# Altium schematic sheet Reader_Schematic.SchDoc
size A4
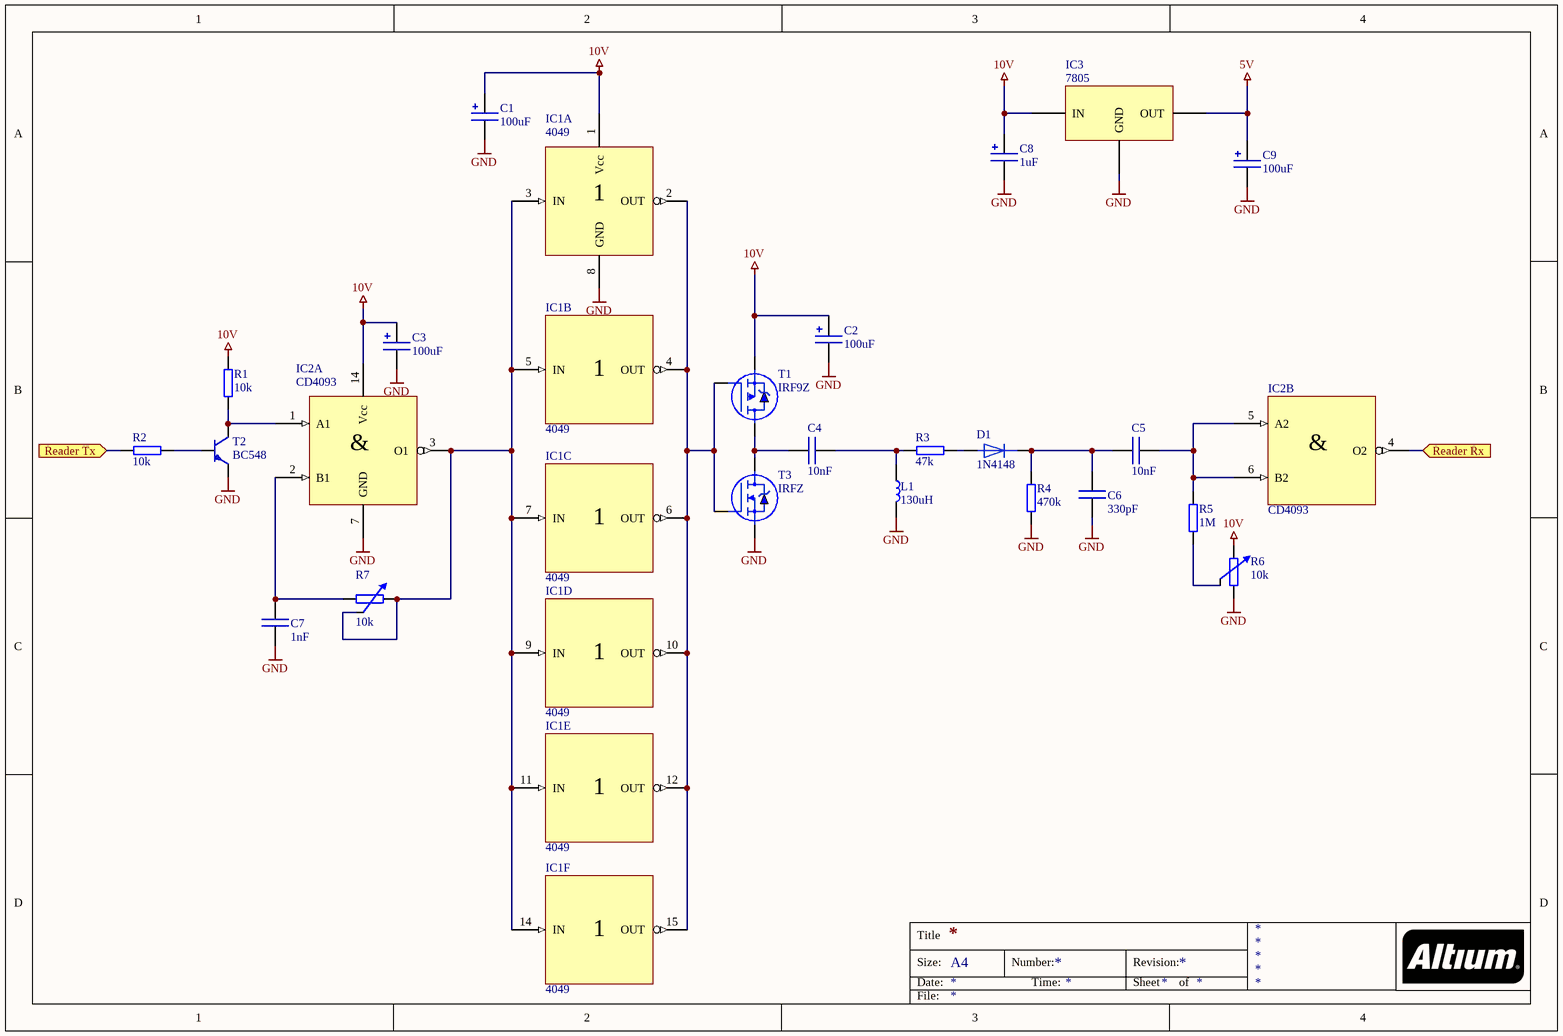
[diagram p0: Reader_Schematic.SchDoc]

## Parts
C1  100uF  [ELKO_10_5.0]
C2  100uF  [ELKO_10_5.0]
C3  100uF  [ELKO_10_5.0]
C4  10nF  [0805]
C5  10nF  [0805]
C6  330pF  [0805]
C7  1nF  [0805]
C8  1uF  [ELKO_10_5.0]
C9  100uF  [ELKO_10_5.0]
D1  1N4148
IC1  4049  (parts A,B,C,D,E,F of 6)
IC2  CD4093  (parts A,B of 4)
IC3  7805
L1  130uH
R1  10k  [Axial-04]
R2  10k  [Axial-04]
R3  47k  [Axial-04]
R4  470k  [Axial-04]
R5  1M  [Axial-04]
R6  10k
R7  10k
T1  IRF9Z  [NDS0610]
T2  BC548  [2SC3324]
T3  IRFZ  [SOT-23]

## Ports
Reader Rx (in), Reader Tx (in)

## Nets
5V: C9.1 IC3.2(OUT)
10V: C1.1 C2.1 C3.1 C8.1 IC1.1(Vcc) IC2.14(Vcc) IC3.1(IN) R1.2 R6.2 T1.2(Source)
GND: C1.2 C2.2 C3.2 C6.1 C7.1 C8.2 C9.2 IC1.8(GND) IC2.7(GND) IC3.3(GND) L1.1 R4.1 R6.1 T2.2(Emitter) T3.3(Source)
Reader Rx: IC2.4(O2) ; port Reader Rx
Reader Tx: R2.1 ; port Reader Tx
NetC4_1: C4.1 T1.3(Drain) T3.2(Drain)
NetC4_2: C4.2 L1.2 R3.1
NetC5_1: C5.1 C6.2 D1.2(Kathode) R4.2
NetC5_2: C5.2 IC2.5(A2) IC2.6(B2) R5.2
NetC7_2: C7.2 IC2.2(B1) R7.1
NetD1_1: D1.1(Anode) R3.2
NetIC1_2: IC1.2(OUT) IC1.4(OUT) IC1.6(OUT) IC1.10(OUT) IC1.12(OUT) IC1.15(OUT) T1.1(Gate) T3.1(Gate)
NetIC1_3: IC1.3(IN) IC1.5(IN) IC1.7(IN) IC1.9(IN) IC1.11(IN) IC1.14(IN) IC2.3(O1) R7.2 R7.3
NetIC2_1: IC2.1(A1) R1.1 T2.3(Collector)
NetR2_2: R2.2 T2.1(Base)
NetR5_1: R5.1 R6.3

## Notes on the sheet
- Title
- Size:
- Date:
- A4
- Number:
- Time:
- Revision:
- Sheet
- of
- File:
- (in symbol 4093, part A) &
- (in symbol 4093, part B) &

## Library data of the parts
C1-C3 C8 C9 = Elko
  C1-C3 C9: VALUE: 100uF
  C8: VALUE: 1uF
C4-C7 = Cap
  C4 C5: VALUE: 10nF
  C6: VALUE: 330pF
  C7: VALUE: 1nF
D1 = Diode
IC1 = 4049: Hex Inverter
IC2 = 4093: Quad NAND with Schmitt Output
IC3 = 7805: 5V Voltage regulator
L1 = Inductor: Value: 130uH
R1-R5 = Res
  R1 R2: VALUE: 10k
  R3: VALUE: 47k
  R4: Value: 470k
  R5: Value: 1M
R6 R7 = Potentiometer
T1 = MOSFET P-Channel
T2 = NPN
T3 = MOSFET N-Channel: pin to pad: 2>3 3>2